# EasyEDA schematic 1-Schematic_SmartPlugV2.json
TITLE: Smart Plug; REV: 1.0; Date: 2021-10-17; Sheet: 1/1; Drawn By: Salvatore Nicosia; Company: HomeGrid
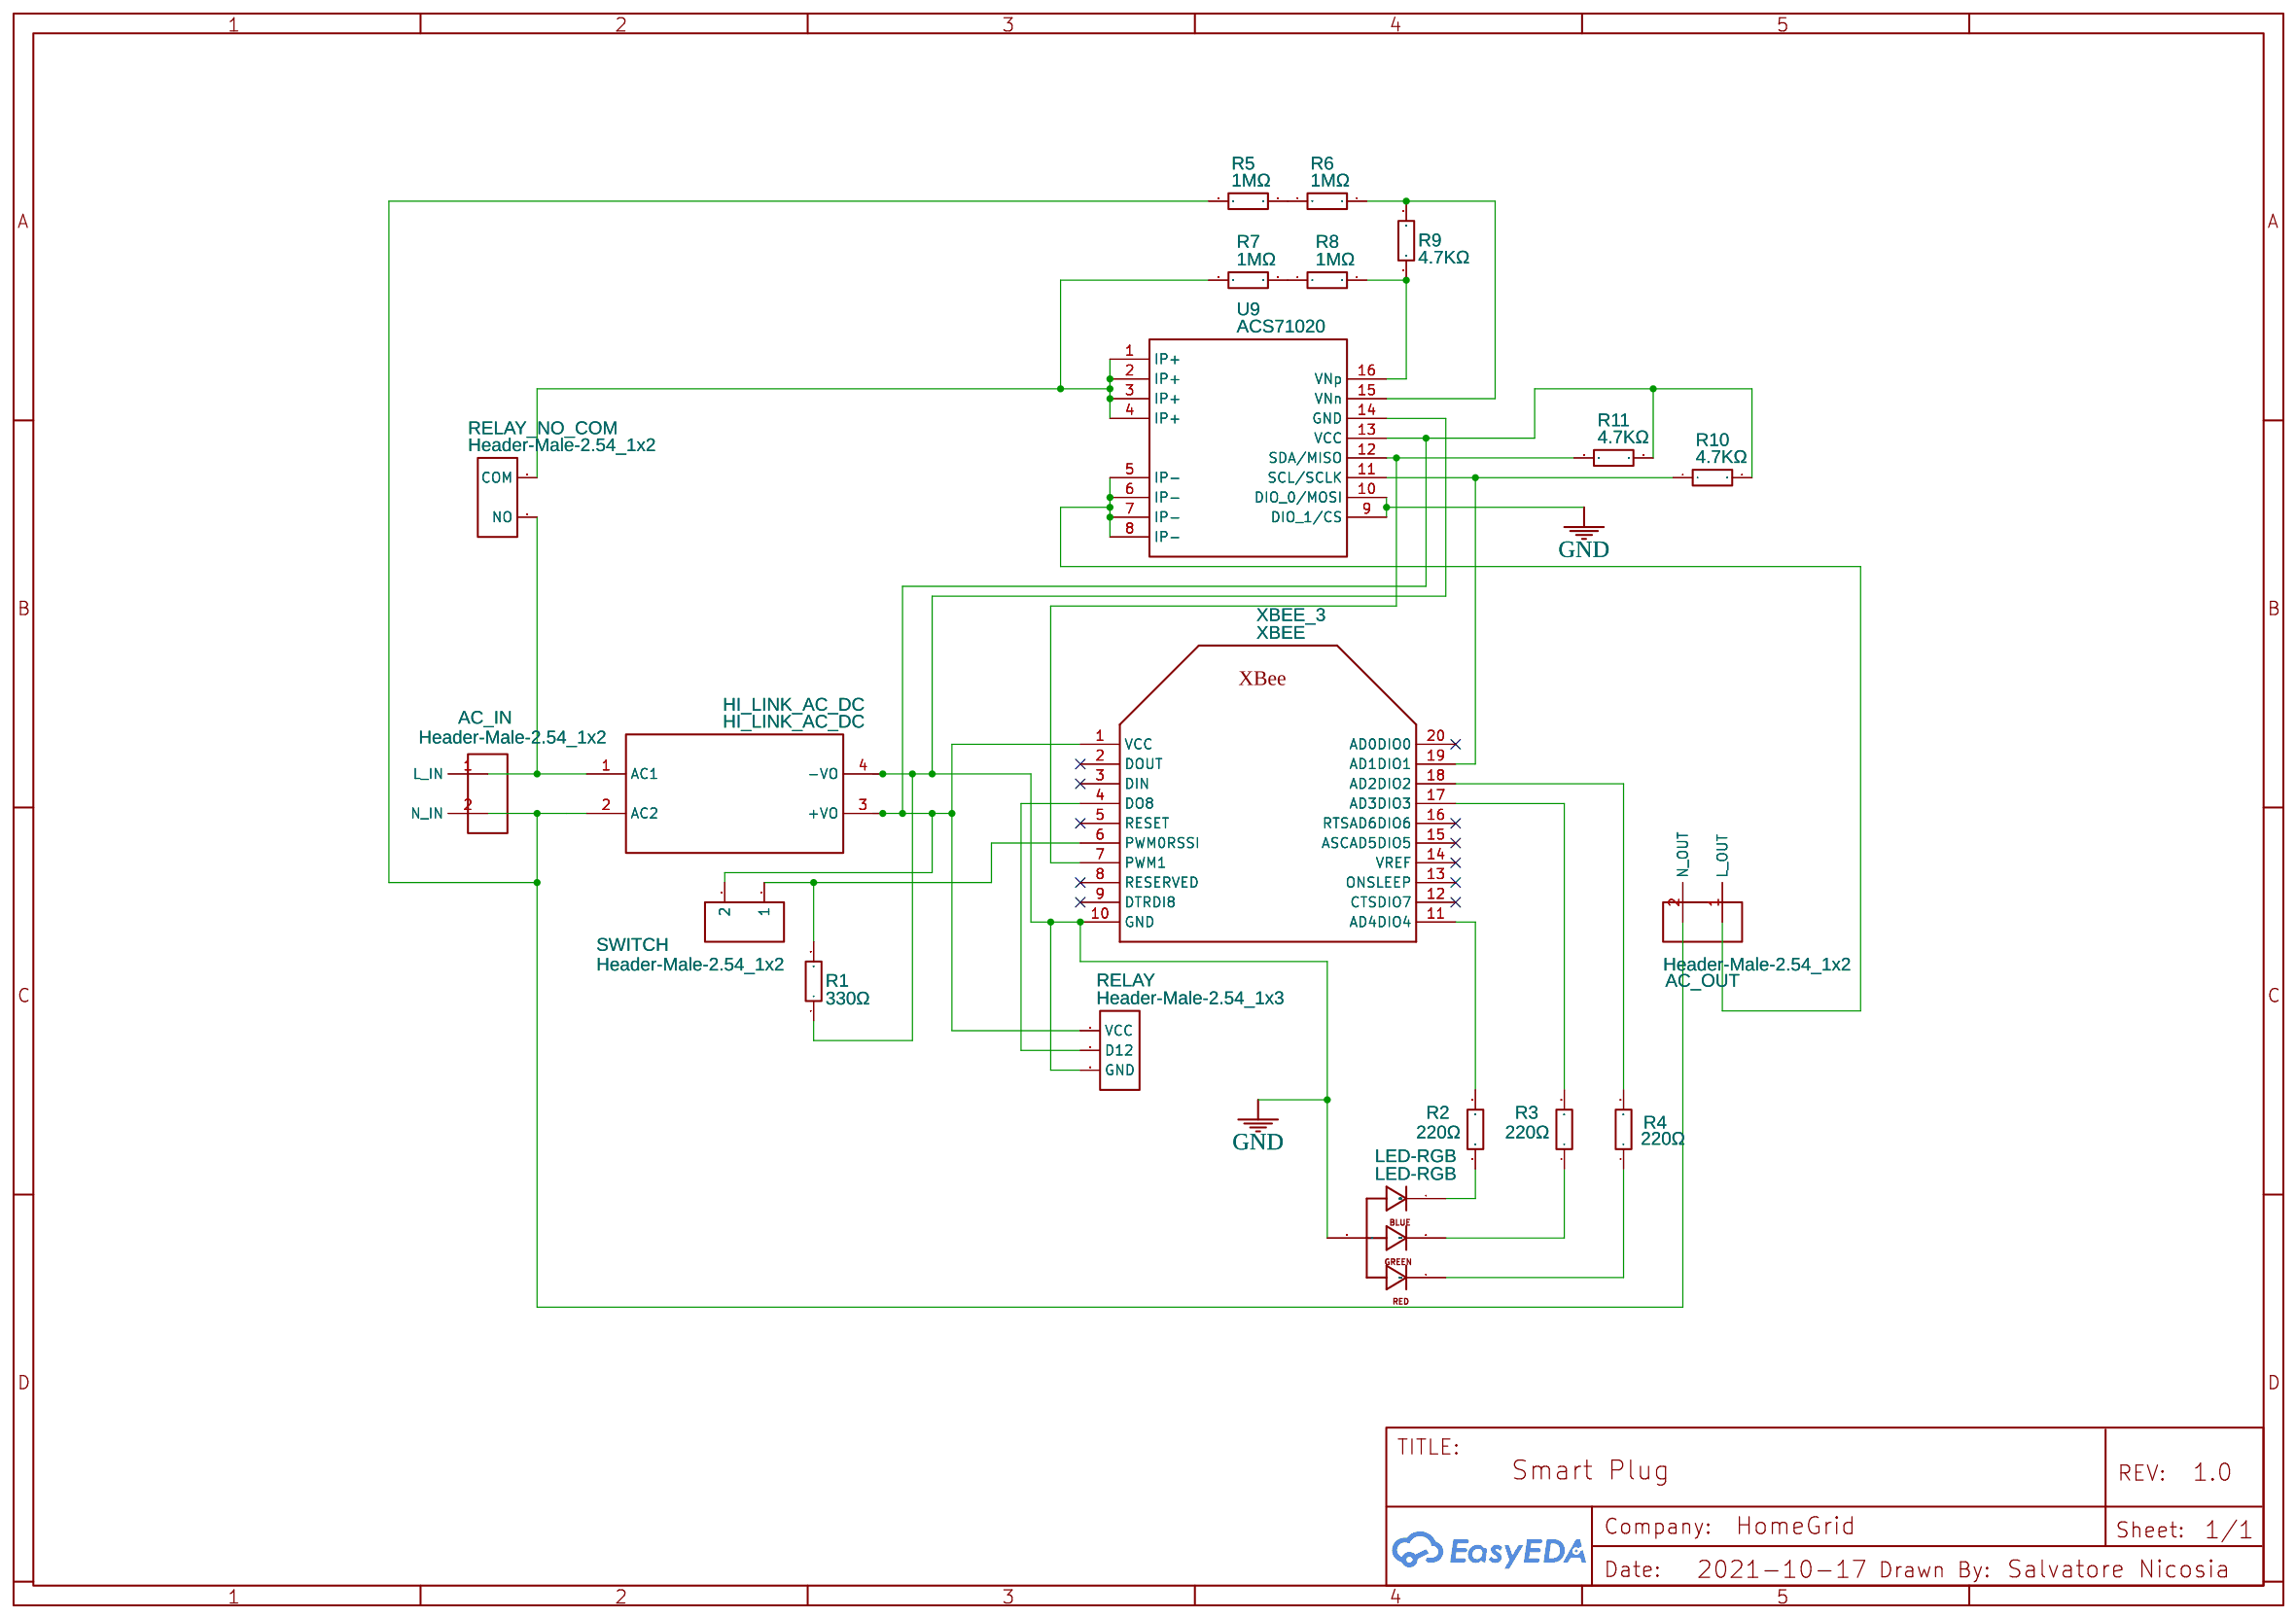
[diagram p0: schematic sheet]

## Parts
AC_IN  Header-Male-2.54_1x2  [DC TERMINALS (2)]
AC_OUT  Header-Male-2.54_1x2  [DC TERMINALS (2)]
HI_LINK_AC_DC  HI_LINK_AC_DC  [HI_LINK_AC_DC]
LED-RGB  LED-RGB  [LED-RGB-THRU]
R1  330Ω  [RESISTOR_7.62_1/4W]
R2  220Ω  [RESISTOR_7.62_1/4W]
R3  220Ω  [RESISTOR_7.62_1/4W]
R4  220Ω  [RESISTOR_7.62_1/4W]
R5  1MΩ  [RESISTOR_7.62_1/4W]
R6  1MΩ  [RESISTOR_7.62_1/4W]
R7  1MΩ  [RESISTOR_7.62_1/4W]
R8  1MΩ  [RESISTOR_7.62_1/4W]
R9  4.7KΩ  [RESISTOR_7.62_1/4W]
R10  4.7KΩ  [RESISTOR_7.62_1/4W]
R11  4.7KΩ  [RESISTOR_7.62_1/4W]
RELAY  Header-Male-2.54_1x3  [HDR-TH_3P-P2.54-V-M-1]
RELAY_NO_COM  Header-Male-2.54_1x2  [HDR-TH_2P-P2.54-V-M-1]
SWITCH  Header-Male-2.54_1x2  [HDR-TH_2P-P2.54-V-M-1]
U9  ACS71020  [ACS71020]
XBEE_3  XBEE  [XBEE]

## Library data of the parts
AC_IN AC_OUT = DC Terminals (2): Contributor: Ankur Jain
HI_LINK_AC_DC = HI_LINK_AC_DC: Contributor: rohan.d
LED-RGB = LED-RGB-CA-THRUCLEAR: RGB Through-hole common anode; Contributor: SparkFun
R1-R11 = resistor 1k: Contributor: schnacksler
RELAY = Header-Male-2.54_1x3: Supplier: LCSC; Manufacturer: BOOMELE; Manufacturer Part: Header2.54mm 1*3P; Supplier Part: C49257; JLCPCB Part Class: Extended Part
RELAY_NO_COM SWITCH = Header-Male-2.54_1x2: Supplier: LCSC; Manufacturer: TE Connectivity; Manufacturer Part: 826629-2; Supplier Part: C86471; JLCPCB Part Class: Extended Part
U9 = ACS71020: Manufacturer: Allegro MicroSystens; Manufacturer Part: ACS71020KMABTR-090B3-I2C; Supplier: Digi-Key; Supplier Part: 620-1998-1-ND; link: https://www.allegromicro.com/-/media/Files/Datasheets/ACS71020-Datasheet.ashx; Contributor: oeneo
XBEE_3 = XBEE: Contributor: Adafruit

## Nets
GND: HI_LINK_AC_DC.4(-VO) LED-RGB.2(ANODE) R1.1 RELAY.3(GND) U9.9(DIO_1/CS) U9.10(DIO_0/MOSI) U9.14(GND) XBEE_3.10(GND)
Net-(AC_IN-1): AC_IN.1(L_IN) HI_LINK_AC_DC.1(AC1) RELAY_NO_COM.1(NO)
Net-(AC_IN-2): AC_IN.2(N_IN) AC_OUT.2(N_OUT) HI_LINK_AC_DC.2(AC2) R5.2
Net-(AC_OUT-1): AC_OUT.1(L_OUT) U9.5(IP-) U9.6(IP-) U9.7(IP-) U9.8(IP-)
Net-(HI_LINK_AC_DC-3): HI_LINK_AC_DC.3(+VO) R10.2 R11.2 RELAY.1(VCC) SWITCH.2 U9.13(VCC) XBEE_3.1(VCC)
Net-(LED-RGB-1): LED-RGB.1(RED_CATHODE) R4.1
Net-(LED-RGB-3): LED-RGB.3(GREEN_CATHODE) R3.1
Net-(LED-RGB-4): LED-RGB.4(BLUE_CATHODE) R2.1
Net-(R1-2): R1.2 SWITCH.1 XBEE_3.6(PWM0RSSI)
Net-(R2-2): R2.2 XBEE_3.11(AD4DIO4)
Net-(R3-2): R3.2 XBEE_3.17(AD3DIO3)
Net-(R4-2): R4.2 XBEE_3.18(AD2DIO2)
Net-(R5-1): R5.1 R6.2
Net-(R6-1): R6.1 R9.2 U9.15(VNn)
Net-(R7-1): R7.1 R8.2
Net-(R7-2): R7.2 RELAY_NO_COM.2(COM) U9.1(IP+) U9.2(IP+) U9.3(IP+) U9.4(IP+)
Net-(R8-1): R8.1 R9.1 U9.16(VNp)
Net-(R10-1): R10.1 U9.11(SCL/SCLK) XBEE_3.19(AD1DIO1)
Net-(R11-1): R11.1 U9.12(SDA/MISO) XBEE_3.7(PWM1)
Net-(RELAY-2): RELAY.2(D12) XBEE_3.4(DO8)

Not connected (* = marked no-connect by the designer): XBEE_3 2(DOUT)* 3(DIN)* 5(RESET)* 8(RESERVED)* 9(DTRDI8)* 12(CTSDIO7)* 13(ONSLEEP)* 14(VREF)* 15(ASCAD5DIO5)* 16(RTSAD6DIO6)* 20(AD0DIO0)*
